# EAGLE schematic aprs_tracker_v5 (EAGLE 9.6.2)

## Sheet 1 of 2
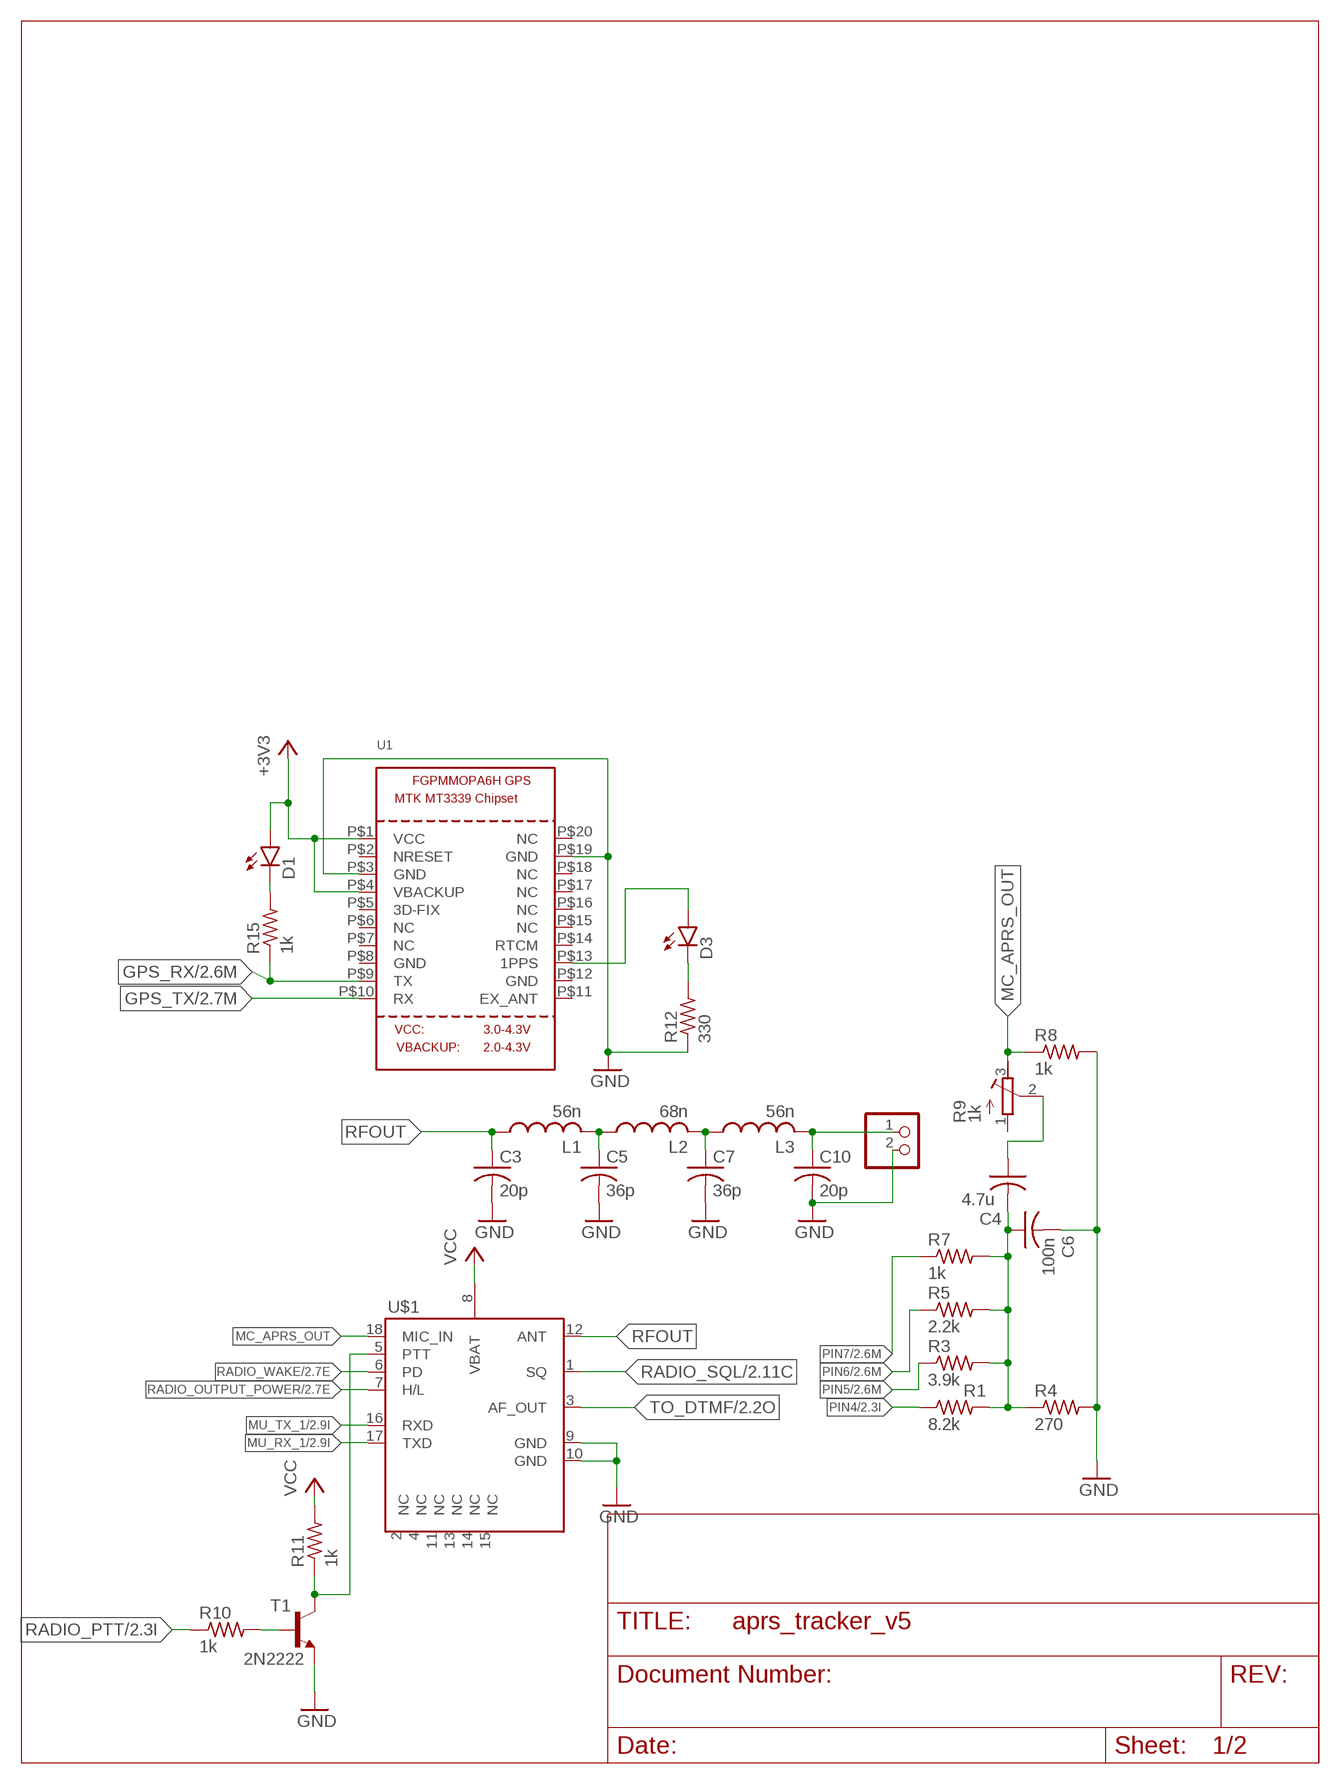
[diagram p0: schematic, sheet 1]

### Parts
C3  20p  C-USC0805K  [C0805K]
C4  4.7u  C-USC0805  [C0805]
C5  36p  C-USC0805K  [C0805K]
C6  100n  C-USC0805  [C0805]
C7  36p  C-USC0805K  [C0805K]
C10  20p  C-USC0805K  [C0805K]
D1  LEDCHIP-LED0805  [CHIP-LED0805]
D3  LEDCHIP-LED0805  [CHIP-LED0805]
L1  56n  L-USL3216C  [L3216C]
L2  68n  L-USL3216C  [L3216C]
L3  56n  L-USL3216C  [L3216C]
R1  8.2k  R-US_R0805  [R0805]
R3  3.9k  R-US_R0805  [R0805]
R4  270  R-US_R0805  [R0805]
R5  2.2k  R-US_R0805  [R0805]
R7  1k  R-US_R0805  [R0805]
R8  1k  R-US_R0805  [R0805]
R9  1k  R-TRIMM3339P  [RTRIM3339P]
R10  1k  R-US_R0805  [R0805]
R11  1k  R-US_R0805  [R0805]
R12  330  R-US_R0805  [R0805]
R15  1k  R-US_R0805  [R0805]
T1  2N2222  [TO92-EBC-OVAL]
U1  GPS_FGPMMOPA6H  [FGPMMOPA6H]
U$1  DRA818A  [DRA818A]
X1  PINHD-1X2  [1X02]

### Nets
+3V3 [PWR]: D1.A U1.P$1(VCC) U1.P$4(VBACKUP) ; also sheet 2
GND [V_bat]: C3.2 C5.2 C6.2 C7.2 C10.2 R4.2 R8.2 R12.1 T1.E U1.P$3(GND) U1.P$19(GND) U$1.9(GND) U$1.10(GND) X1.2 ; also sheet 2
GPS_RX: R15.1 U1.P$9(TX) ; also sheet 2
GPS_TX: U1.P$10(RX) ; also sheet 2
MC_APRS_OUT: R8.1 R9.3(E) U$1.18(MIC_IN)
MU_RX_1: U$1.17(TXD) ; also sheet 2
MU_TX_1: U$1.16(RXD) ; also sheet 2
N$2 [50 ohm]: C5.1 L1.2 L2.1
N$3: D1.C R15.2
N$4 [50 ohm]: C7.1 L2.2 L3.1
N$8 [50 ohm]: C10.1 L3.2 X1.1
N$10: C4.2 C6.1 R1.2 R3.2 R4.1 R5.2 R7.2
N$11: C4.1 R9.2(S)
N$12: R11.1 T1.C U$1.5(PTT)
N$14: R10.2 T1.B
N$20: D3.C R12.2
N$23: D3.A U1.P$13(1PPS)
PIN4: R1.1 ; also sheet 2
PIN5: R3.1 ; also sheet 2
PIN6: R5.1 ; also sheet 2
PIN7: R7.1 ; also sheet 2
RADIO_OUTPUT_POWER: U$1.7(H/L) ; also sheet 2
RADIO_PTT: R10.1 ; also sheet 2
RADIO_SQL: U$1.1(SQ) ; also sheet 2
RADIO_WAKE: U$1.6(PD) ; also sheet 2
RFOUT [50 ohm]: C3.1 L1.1 U$1.12(ANT)
TO_DTMF: U$1.3(AF_OUT) ; also sheet 2
VCC [PWR]: R11.2 U$1.8(VBAT) ; also sheet 2
Unconnected: R9.1(A) U1.P$2(NRESET) U1.P$5(3D-FIX) U1.P$6(NC) U1.P$7(NC) U1.P$8(GND) U1.P$11(EX_ANT) U1.P$12(GND) U1.P$14(RTCM) U1.P$15(NC) U1.P$16(NC) U1.P$17(NC) U1.P$18(NC) U1.P$20(NC) U$1.2(NC) U$1.4(NC) U$1.11(NC) U$1.13(NC) U$1.14(NC) U$1.15(NC)

## Sheet 2 of 2
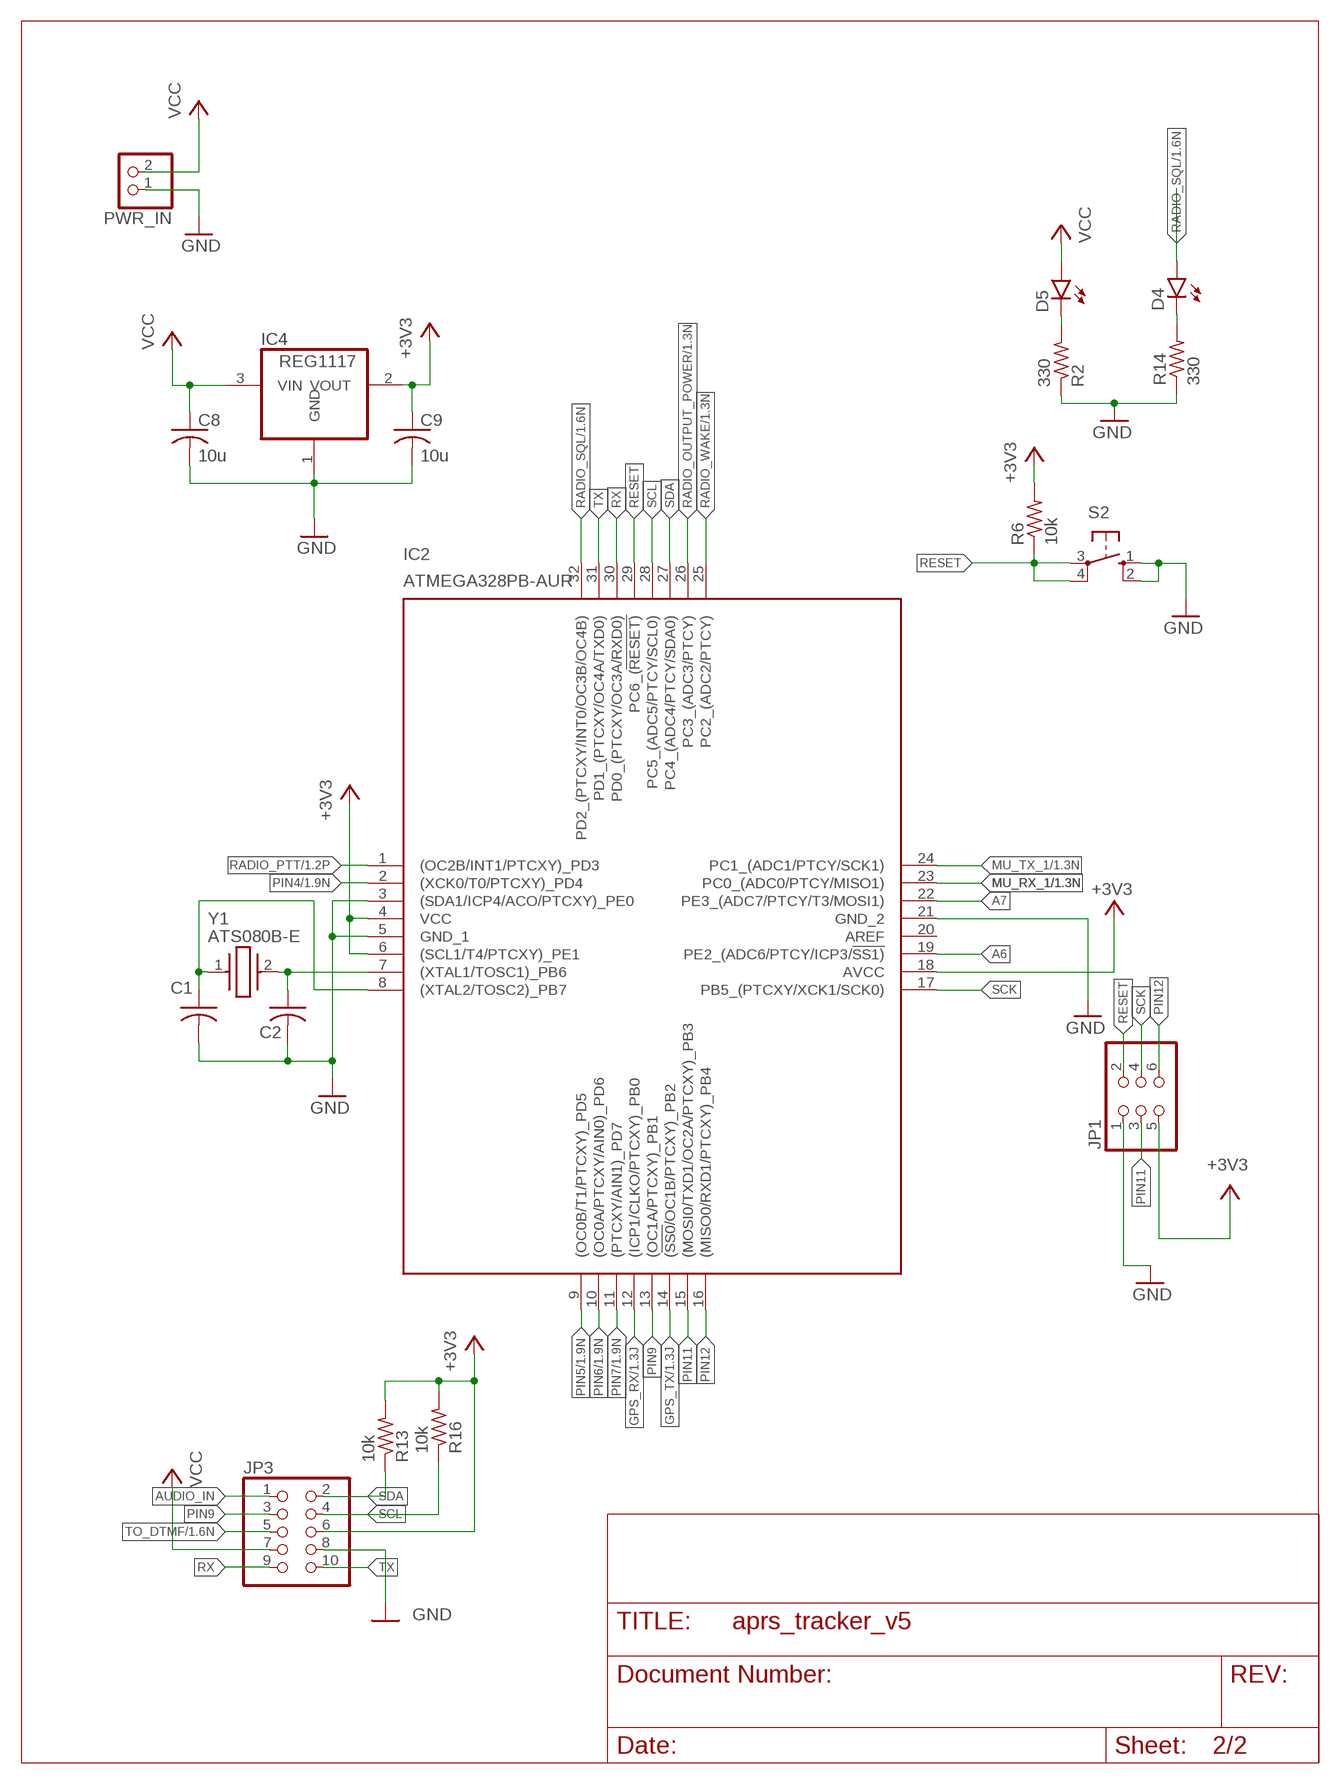
[diagram p1: schematic, sheet 2]

### Parts
C1  C-USC0805  [C0805]
C2  C-USC0805  [C0805]
C8  10u  C-USC0805  [C0805]
C9  10u  C-USC0805  [C0805]
D4  LEDCHIP-LED0805  [CHIP-LED0805]
D5  LEDCHIP-LED0805  [CHIP-LED0805]
IC2  ATMEGA328PB-AUR  [QFP80P900X900X120-32N]
IC4  REG1117  [SOT223]
JP1  PINHD-2X3  [2X03]
JP3  PINHD-2X5  [2X05]
PWR_IN  PINHD-1X2  [1X02]
R2  330  R-US_R0805  [R0805]
R6  10k  R-US_R0805  [R0805]
R13  10k  R-US_R0805  [R0805]
R14  330  R-US_R0805  [R0805]
R16  10k  R-US_R0805  [R0805]
S2  10-XX  [B3F-10XX]
Y1  ATS080B-E  [ATS080BE]

### Nets
+3V3 [PWR]: C9.1 IC2.4(VCC) IC2.6((SCL1/T4/PTCXY)_PE1) IC2.18(AVCC) IC4.2(VOUT) JP1.5 JP3.6 R6.2 R13.2 R16.2 ; also sheet 1
A6: IC2.19(PE2_(ADC6/PTCY/ICP3/!SS1))
A7: IC2.22(PE3_(ADC7/PTCY/T3/MOSI1))
AUDIO_IN: JP3.1
GND [V_bat]: C1.2 C2.2 C8.2 C9.2 IC2.3((SDA1/ICP4/ACO/PTCXY)_PE0) IC2.5(GND_1) IC2.21(GND_2) IC4.1(GND) JP1.1 JP3.8 PWR_IN.1 R2.1 R14.1 S2.1(S) S2.2(S1) ; also sheet 1
GPS_RX: IC2.12((ICP1/CLKO/PTCXY)_PB0) ; also sheet 1
GPS_TX: IC2.14((!SS0!/OC1B/PTCXY)_PB2) ; also sheet 1
MU_RX_1: IC2.23(PC0_(ADC0/PTCY/MISO1)) ; also sheet 1
MU_TX_1: IC2.24(PC1_(ADC1/PTCY/SCK1)) ; also sheet 1
N$5: D5.C R2.2
N$6: C1.1 IC2.8((XTAL2/TOSC2)_PB7) Y1.1
N$7: C2.1 IC2.7((XTAL1/TOSC1)_PB6) Y1.2
N$22: D4.C R14.2
PIN4: IC2.2((XCK0/T0/PTCXY)_PD4) ; also sheet 1
PIN5: IC2.9((OC0B/T1/PTCXY)_PD5) ; also sheet 1
PIN6: IC2.10((OC0A/PTCXY/AIN0)_PD6) ; also sheet 1
PIN7: IC2.11((PTCXY/AIN1)_PD7) ; also sheet 1
PIN9: IC2.13((OC1A/PTCXY)_PB1) JP3.3
PIN11: IC2.15((MOSI0/TXD1/OC2A/PTCXY)_PB3) JP1.3
PIN12: IC2.16((MISO0/RXD1/PTCXY)_PB4) JP1.6
RADIO_OUTPUT_POWER: IC2.26(PC3_(ADC3/PTCY)) ; also sheet 1
RADIO_PTT: IC2.1((OC2B/INT1/PTCXY)_PD3) ; also sheet 1
RADIO_SQL: D4.A IC2.32(PD2_(PTCXY/INT0/OC3B/OC4B)) ; also sheet 1
RADIO_WAKE: IC2.25(PC2_(ADC2/PTCY)) ; also sheet 1
RESET: IC2.29(PC6_(!RESET)) JP1.2 R6.1 S2.3(P) S2.4(P1)
RX: IC2.30(PD0_(PTCXY/OC3A/RXD0)) JP3.9
SCK: IC2.17(PB5_(PTCXY/XCK1/SCK0)) JP1.4
SCL: IC2.28(PC5_(ADC5/PTCY/SCL0)) JP3.4 R16.1
SDA: IC2.27(PC4_(ADC4/PTCY/SDA0)) JP3.2 R13.1
TO_DTMF: JP3.5 ; also sheet 1
TX: IC2.31(PD1_(PTCXY/OC4A/TXD0)) JP3.10
VCC [PWR]: C8.1 D5.A IC4.3(VIN) JP3.7 PWR_IN.2 ; also sheet 1
Unconnected: IC2.20(AREF)

## Library data of the parts
C1-C10 = rcl:C-US: CAPACITOR, American symbol; SPICEPREFIX: C
D1 D3-D5 = led:LED: LED OSRAM: - CHIPLED LG R971, LG N971, LY N971, LG Q971, LY Q971, LO R971, LY R971 LH N974, LH R974 LS Q976, LO Q976, LY Q976 LO Q996 - Hyper CHIPLED LW Q18S LB Q993, LB Q99A, LB R99A - SideLED LS A670, LO A670, LY A670, LG A670, LP A670 LB A673, LV A673, LT A673, LW A673 LH A674 LY A675 LS A676, LA A676, LO A676, LY A676, LW A676 LS A679, LY A679, LG A679 - Hyper Micro SIDELED® LS Y876, LA Y876, LO Y876, LY Y876 LT Y87S - SmartLED LW L88C, LW L88S LB L89C, LB L89S, LG L890 LS L89K, LO L89K, LY L89K LS L896, LA L896, LO L896, LY L896 - TOPLED LS T670, LO T670, LY T670, LG T670, LP T670 LSG T670, LSP T670, LSY T670, LOP T670, LYG T670 LG T671, LOG T671, LSG T671 LB T673, LV T673, LT T673, LW T673 LH T674 LS T676, LA T676, LO T676, LY T676, LB T676, LH T676, LSB T676, LW T676 LB T67C, LV T67C, LT T67C, LS T67K, LO T67K, LY T67K, LW E67C LS E67B, LA E67B, LO E67B, LY E67B, LB E67C, LV E67C, LT E67C LW T67C LS T679, LY T679, LG T679 LS T770, LO T770, LY T770, LG T770, LP T770 LB T773, LV T773, LT T773, LW T773 LH T774 LS E675, LA E675, LY E675, LS T675 LS T776, LA T776, LO T776, LY T776, LB T776 LHGB T686 LT T68C, LB T68C - Hyper Mini TOPLED® LB M676 - Mini TOPLED Santana® LG M470 LS M47K, LO M47K, LY M47K Source: http://www.osram.convergy.de LUXEON: - LUMILED® LXK2-PW12-R00, LXK2-PW12-S00, LXK2-PW14-U00, LXK2-PW14-V00 LXK2-PM12-R00, LXK2-PM12-S00, LXK2-PM14-U00 LXK2-PE12-Q00, LXK2-PE12-R00, LXK2-PE12-S00, LXK2-PE14-T00, LXK2-PE14-U00 LXK2-PB12-K00, LXK2-PB12-L00, LXK2-PB12-M00, LXK2-PB14-N00, LXK2-PB14-P00, LXK2-PB14-Q00 LXK2-PR12-L00, LXK2-PR12-M00, LXK2-PR14-Q00, LXK2-PR14-R00 LXK2-PD12-Q00, LXK2-PD12-R00, LXK2-PD12-S00 LXK2-PH12-R00, LXK2-PH12-S00 LXK2-PL12-P00, LXK2-PL12-Q00, LXK2-PL12-R00 Source: www.luxeon.com KINGBRIGHT: KA-3528ASYC Source: www.kingbright.com
IC2 = ATMEGA328PB-AUR:ATMEGA328PB-AUR: 8-bit Microcontrollers - MCU ATMEGA328PB IND TEMP T&R Source: Datasheet <http://www.atmel.com/Images/Atmel-42397-8-bit-AVR-Microcontroller-ATmega328PB_Summary.pdf>; DESCRIPTION: 8-bit Microcontrollers - MCU ATMEGA328PB IND TEMP T&R; HEIGHT: 1.2mm; MANUFACTURER_NAME: Microchip; MANUFACTURER_PART_NUMBER: ATMEGA328PB-AUR; MOUSER_PART_NUMBER: 556-ATMEGA328PB-AUR; MOUSER_PRICE-STOCK: https://www.mouser.co.uk/ProductDetail/Microchip-Technology/ATMEGA328PB-AUR?qs=jy4bLUHv09i4S8%252BfUeCffg%3D%3D
IC4 = burr-brown:REG1117: 800mA and 1A Low Dropout (LDO) Positive Regulator 1.8V, 2.5V, 2.85V, 3.3V, 5V, and Adj; MPN: REG1117; OC_FARNELL: 1097566; OC_NEWARK: 14P6981
JP1 = pinhead:PINHD-2X3: PIN HEADER
JP3 = pinhead:PINHD-2X5: PIN HEADER
L1-L3 = rcl:L-US: INDUCTOR, American symbol; SPICEPREFIX: L
PWR_IN X1 = pinhead:PINHD-1X2: PIN HEADER
R1-R8 R10-R16 = rcl:R-US_: RESISTOR, American symbol; SPICEPREFIX: R
R9 = rcl:R-TRIMM: Trimm resistor; SPICEMODEL: X; SPICEPREFIXL: POT
S2 = switch-omron:10-XX: OMRON SWITCH; MPN: B3F-1000; OC_FARNELL: 176432; OC_NEWARK: 36M3542
T1 = adafruit:2N2222: NPN TRANSISTOR Big oval pads
U1 = adafruit:GPS_FGPMMOPA6H: GPS Module - MTK MT3339 Chipset, -165dBm sensitivity, 22 channels, 10Hz, auto-select external antenna options
U$1 = dorji:DRA818A
Y1 = ATS080B-E:ATS080B-E: Crystals 8MHz 18pF Fund. -40C +85C Source: Datasheet; DESCRIPTION: Crystals 8MHz 18pF Fund. -40C +85C; HEIGHT: 3.68mm; MANUFACTURER_NAME: CTS; MANUFACTURER_PART_NUMBER: ATS080B-E; MOUSER_PART_NUMBER: 774-ATS080B-E; MOUSER_PRICE-STOCK: https://www.mouser.co.uk/ProductDetail/CTS-Electronic-Components/ATS080B-E?qs=EyvxYzk7Sd1vYvYpN4HpEw%3D%3D

## Net classes
0 default: width 0.229 mm, clearance 0.152 mm
1 PWR: width 0.508 mm, clearance 0.152 mm
2 V_bat: width 0.305 mm, clearance 0.152 mm
3 50 ohm: width 1.21 mm, clearance 0.26 mm